# EAGLE schematic secondary (EAGLE 9.6.2)
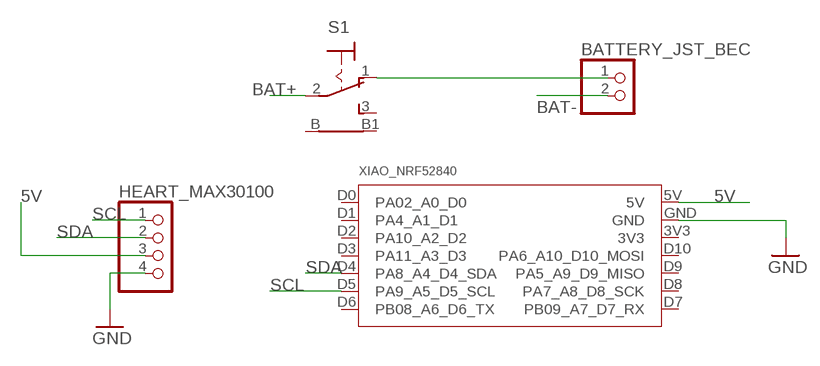
[diagram p0: schematic, sheet 1]

## Parts
BATTERY_JST_BEC  PINHD-1X2  [1X02]
HEART_MAX30100  PINHD-1X4  [1X04]
S1  316-917  [316-917]
XIAO_NRF52840  SEEED-STUDIO-XIAO-SAMD21-BLE-SMD  [XIAO-NRF52840-SMD]

## Nets
5V: HEART_MAX30100.3 XIAO_NRF52840.5V
BAT+: S1.2(P)
BAT-: BATTERY_JST_BEC.2
GND: HEART_MAX30100.4 XIAO_NRF52840.GND
N$1: BATTERY_JST_BEC.1 S1.1(O)
SCL: HEART_MAX30100.1 XIAO_NRF52840.D5(PA9_A5_D5_SCL)
SDA: HEART_MAX30100.2 XIAO_NRF52840.D4(PA8_A4_D4_SDA)
Unconnected: S1.3(S) S1.B S1.B1 XIAO_NRF52840.3V3 XIAO_NRF52840.D0(PA02_A0_D0) XIAO_NRF52840.D1(PA4_A1_D1) XIAO_NRF52840.D2(PA10_A2_D2) XIAO_NRF52840.D3(PA11_A3_D3) XIAO_NRF52840.D6(PB08_A6_D6_TX) XIAO_NRF52840.D7(PB09_A7_D7_RX) XIAO_NRF52840.D8(PA7_A8_D8_SCK) XIAO_NRF52840.D9(PA5_A9_D9_MISO) XIAO_NRF52840.D10(PA6_A10_D10_MOSI)

## Library data of the parts
BATTERY_JST_BEC = pinhead:PINHD-1X2: PIN HEADER
HEART_MAX30100 = pinhead:PINHD-1X4: PIN HEADER
S1 = switch:316-917: TOGGLE SWITCH Mors, distributor RS Components
XIAO_NRF52840 = Seeed Studio XIAO:SEEED-STUDIO-XIAO-SAMD21